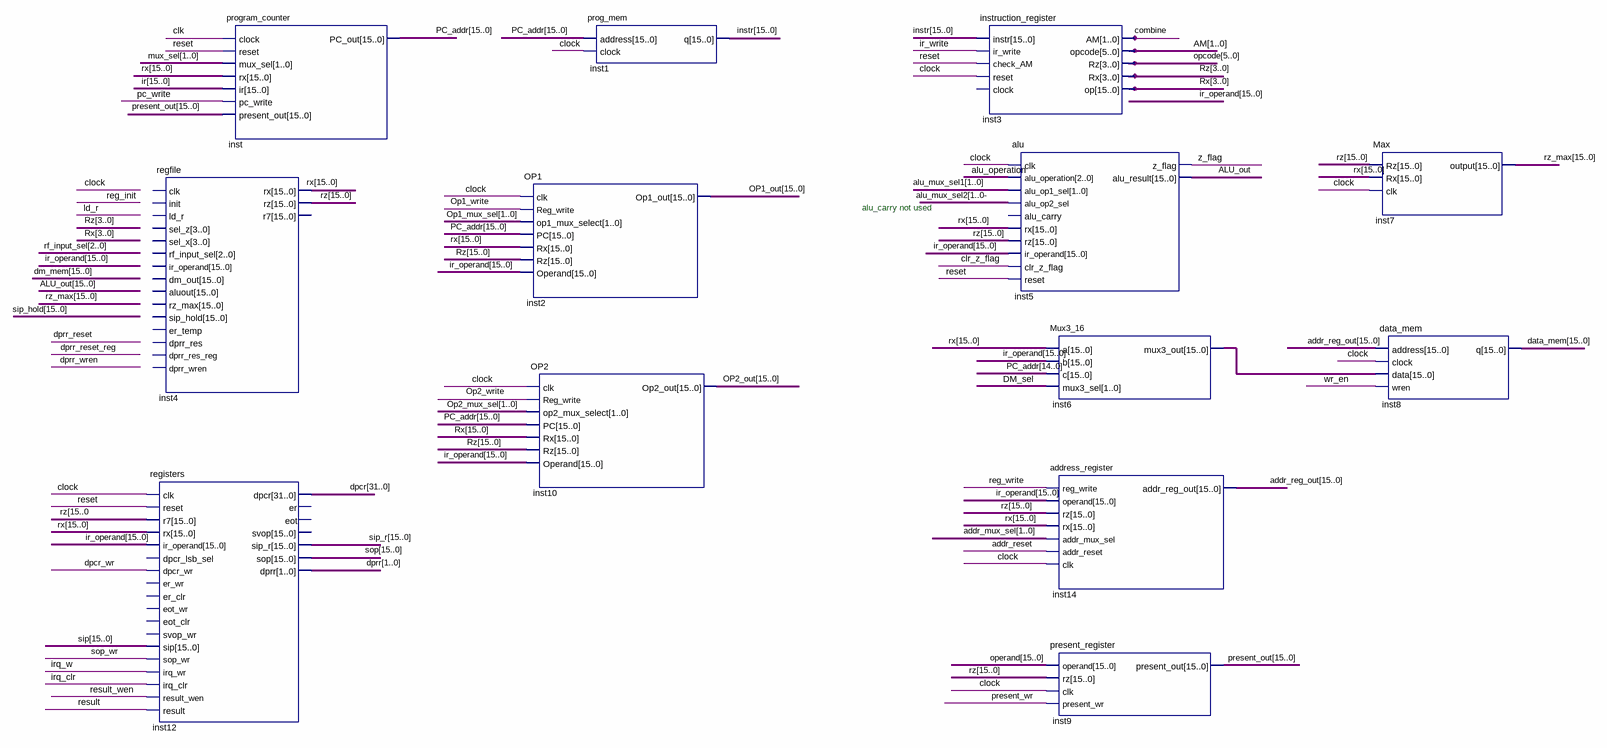
[diagram p0: schematic sheet]
// Quartus schematic ReCOP.bdf as structural Verilog: 13 symbols, 0 pins
module ReCOP (
);

  wire addr_reset, \alu_mux_sel2[1..0- , alu_operation, ALU_out, clk, clock, clr_z_flag, combine, DM_sel,
       dpcr_wr, ir_write, irq_clr, irq_w, Op1_write, Op2_write, pc_write, present_wr, reg_write, reset,
       result, result_wen, \rz[15..0 , sop_wr, wr_en, z_flag;
  wire [1:0] addr_mux_sel, alu_mux_sel1, AM, dprr, mux_sel, Op1_mux_sel, Op2_mux_sel;
  wire [5:0] opcode;
  wire [15:0] addr_reg_out, data_mem, inst6_mux3_out, instr, ir, ir_operand, OP1_out, OP2_out, operand,
       PC_addr, present_out, rx, rz, rz_max, sip, sip_r, sop;
  wire [31:0] dpcr;

  regfile inst4 (
    .rx(rx), .rz(rz));  // open: clk, init, ld_r, sel_z, sel_x, rf_input_sel, ir_operand, dm_out, aluout, rz_max, sip_hold, er_temp, dprr_res, dprr_res_reg, dprr_wren, r7
  registers inst12 (
    .clk(clock), .reset(reset), .r7({16{\rz[15..0 }}), .rx(rx), .ir_operand(ir_operand), .dpcr_wr(dpcr_wr),
    .sip(sip), .sop_wr(sop_wr), .irq_wr(irq_w), .irq_clr(irq_clr), .result_wen(result_wen), .result(result),
    .dpcr(dpcr), .sip_r(sip_r), .sop(sop), .dprr(dprr));  // open: dpcr_lsb_sel, er_wr, er_clr, eot_wr, eot_clr, svop_wr, er, eot, svop
  program_counter inst (
    .clock(clk), .reset(reset), .mux_sel(mux_sel), .rx(rx), .ir(ir), .pc_write(pc_write),
    .present_out(present_out), .PC_out(PC_addr));
  OP1 inst2 (
    .clk(clock), .Reg_write(Op1_write), .op1_mux_select(Op1_mux_sel), .PC(PC_addr), .Rx(rx), .Rz(rz),
    .Operand(ir_operand), .Op1_out(OP1_out));
  OP2 inst10 (
    .clk(clock), .Reg_write(Op2_write), .op2_mux_select(Op2_mux_sel), .PC(PC_addr), .Rx(rx), .Rz(rz),
    .Operand(ir_operand), .Op2_out(OP2_out));
  prog_mem inst1 (.address(PC_addr), .clock(clock), .q(instr));
  instruction_register inst3 (
    .instr(instr), .ir_write(ir_write), .check_AM(reset), .reset(clock), .AM(combine), .opcode(AM),
    .Rz(opcode), .Rx(rz[3:0]), .op(rx[3:0]));  // open: clock
  alu inst5 (
    .clk(clock), .alu_operation({3{alu_operation}}), .alu_op1_sel(alu_mux_sel1),
    .alu_op2_sel(\alu_mux_sel2[1..0- ), .rx(rx), .rz(rz), .ir_operand(ir_operand), .clr_z_flag(clr_z_flag),
    .reset(reset), .z_flag(z_flag), .alu_result(ALU_out));  // open: alu_carry
  Mux3_16 inst6 (.a(rx), .b(ir_operand), .c(PC_addr[14:0]), .mux3_sel({2{DM_sel}}), .mux3_out(inst6_mux3_out));
  address_register inst14 (
    .reg_write(reg_write), .operand(ir_operand), .rz(rz), .rx(rx), .addr_mux_sel(addr_mux_sel),
    .addr_reset(addr_reset), .clk(clock), .addr_reg_out(addr_reg_out));
  present_register inst9 (.operand(operand), .rz(rz), .clk(clock), .present_wr(present_wr), .present_out(present_out));
  Max inst7 (.Rz(rz), .Rx(rx), .clk(clock), .\output (rz_max));
  data_mem inst8 (.address(addr_reg_out), .clock(clock), .data(inst6_mux3_out), .wren(wr_en), .q(data_mem));

  // Notes on the sheet:
  //   alu_carry not used
endmodule
